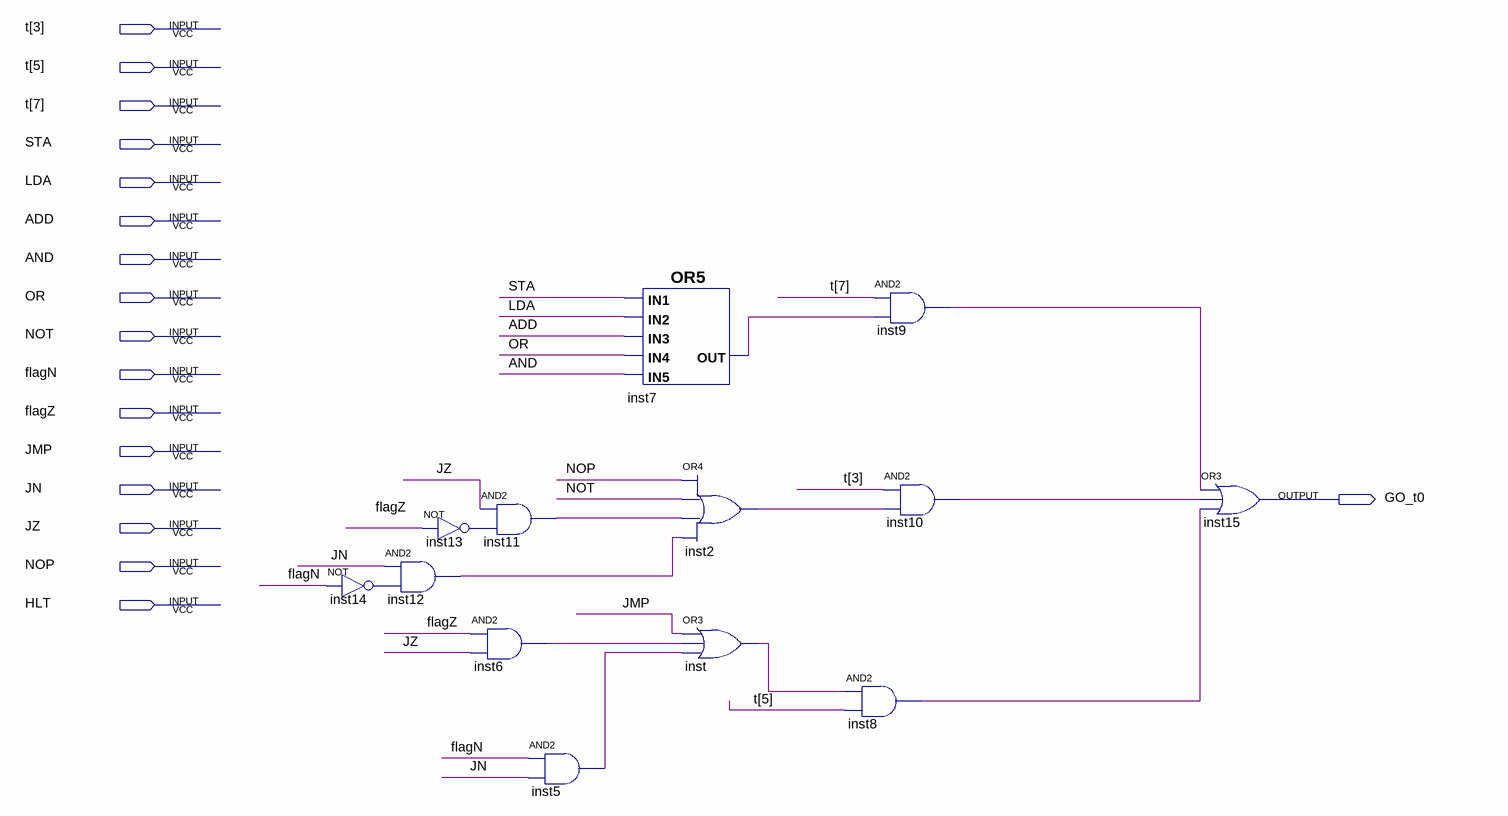
[diagram p0: schematic sheet]
// Quartus schematic GO_t0_LOGIC.bdf as structural Verilog: 13 symbols, 17 pins
module GO_t0_LOGIC (
  input  [7:3] t,
  input  STA,
  input  LDA,
  input  ADD,
  input  AND,
  input  OR,
  input  NOT,
  input  flagN,
  input  flagZ,
  input  JMP,
  input  JN,
  input  JZ,
  input  NOP,
  input  HLT,
  output GO_t0
);

  wire inst2_out, inst5_out, inst6_out, inst7_out, inst8_out, inst9_out, inst10_out, inst11_out, inst12_out,
       inst13_out, inst14_out, inst_out;

  and inst12 (inst12_out, JN, inst14_out);
  not inst14 (inst14_out, flagN);
  not inst13 (inst13_out, flagZ);
  and inst6 (inst6_out, flagZ, JZ);
  and inst11 (inst11_out, JZ, inst13_out);
  and inst5 (inst5_out, flagN, JN);
  or inst7 (inst7_out, STA, LDA, ADD, OR, AND);
  or inst2 (inst2_out, NOP, NOT, inst11_out, inst12_out);
  or inst (inst_out, JMP, inst6_out, inst5_out);
  and inst8 (inst8_out, inst_out, t[5]);
  and inst9 (inst9_out, t[7], inst7_out);
  and inst10 (inst10_out, t[3], inst2_out);
  or inst15 (GO_t0, inst9_out, inst10_out, inst8_out);
endmodule
